# Altium project BMS.PrjPcb
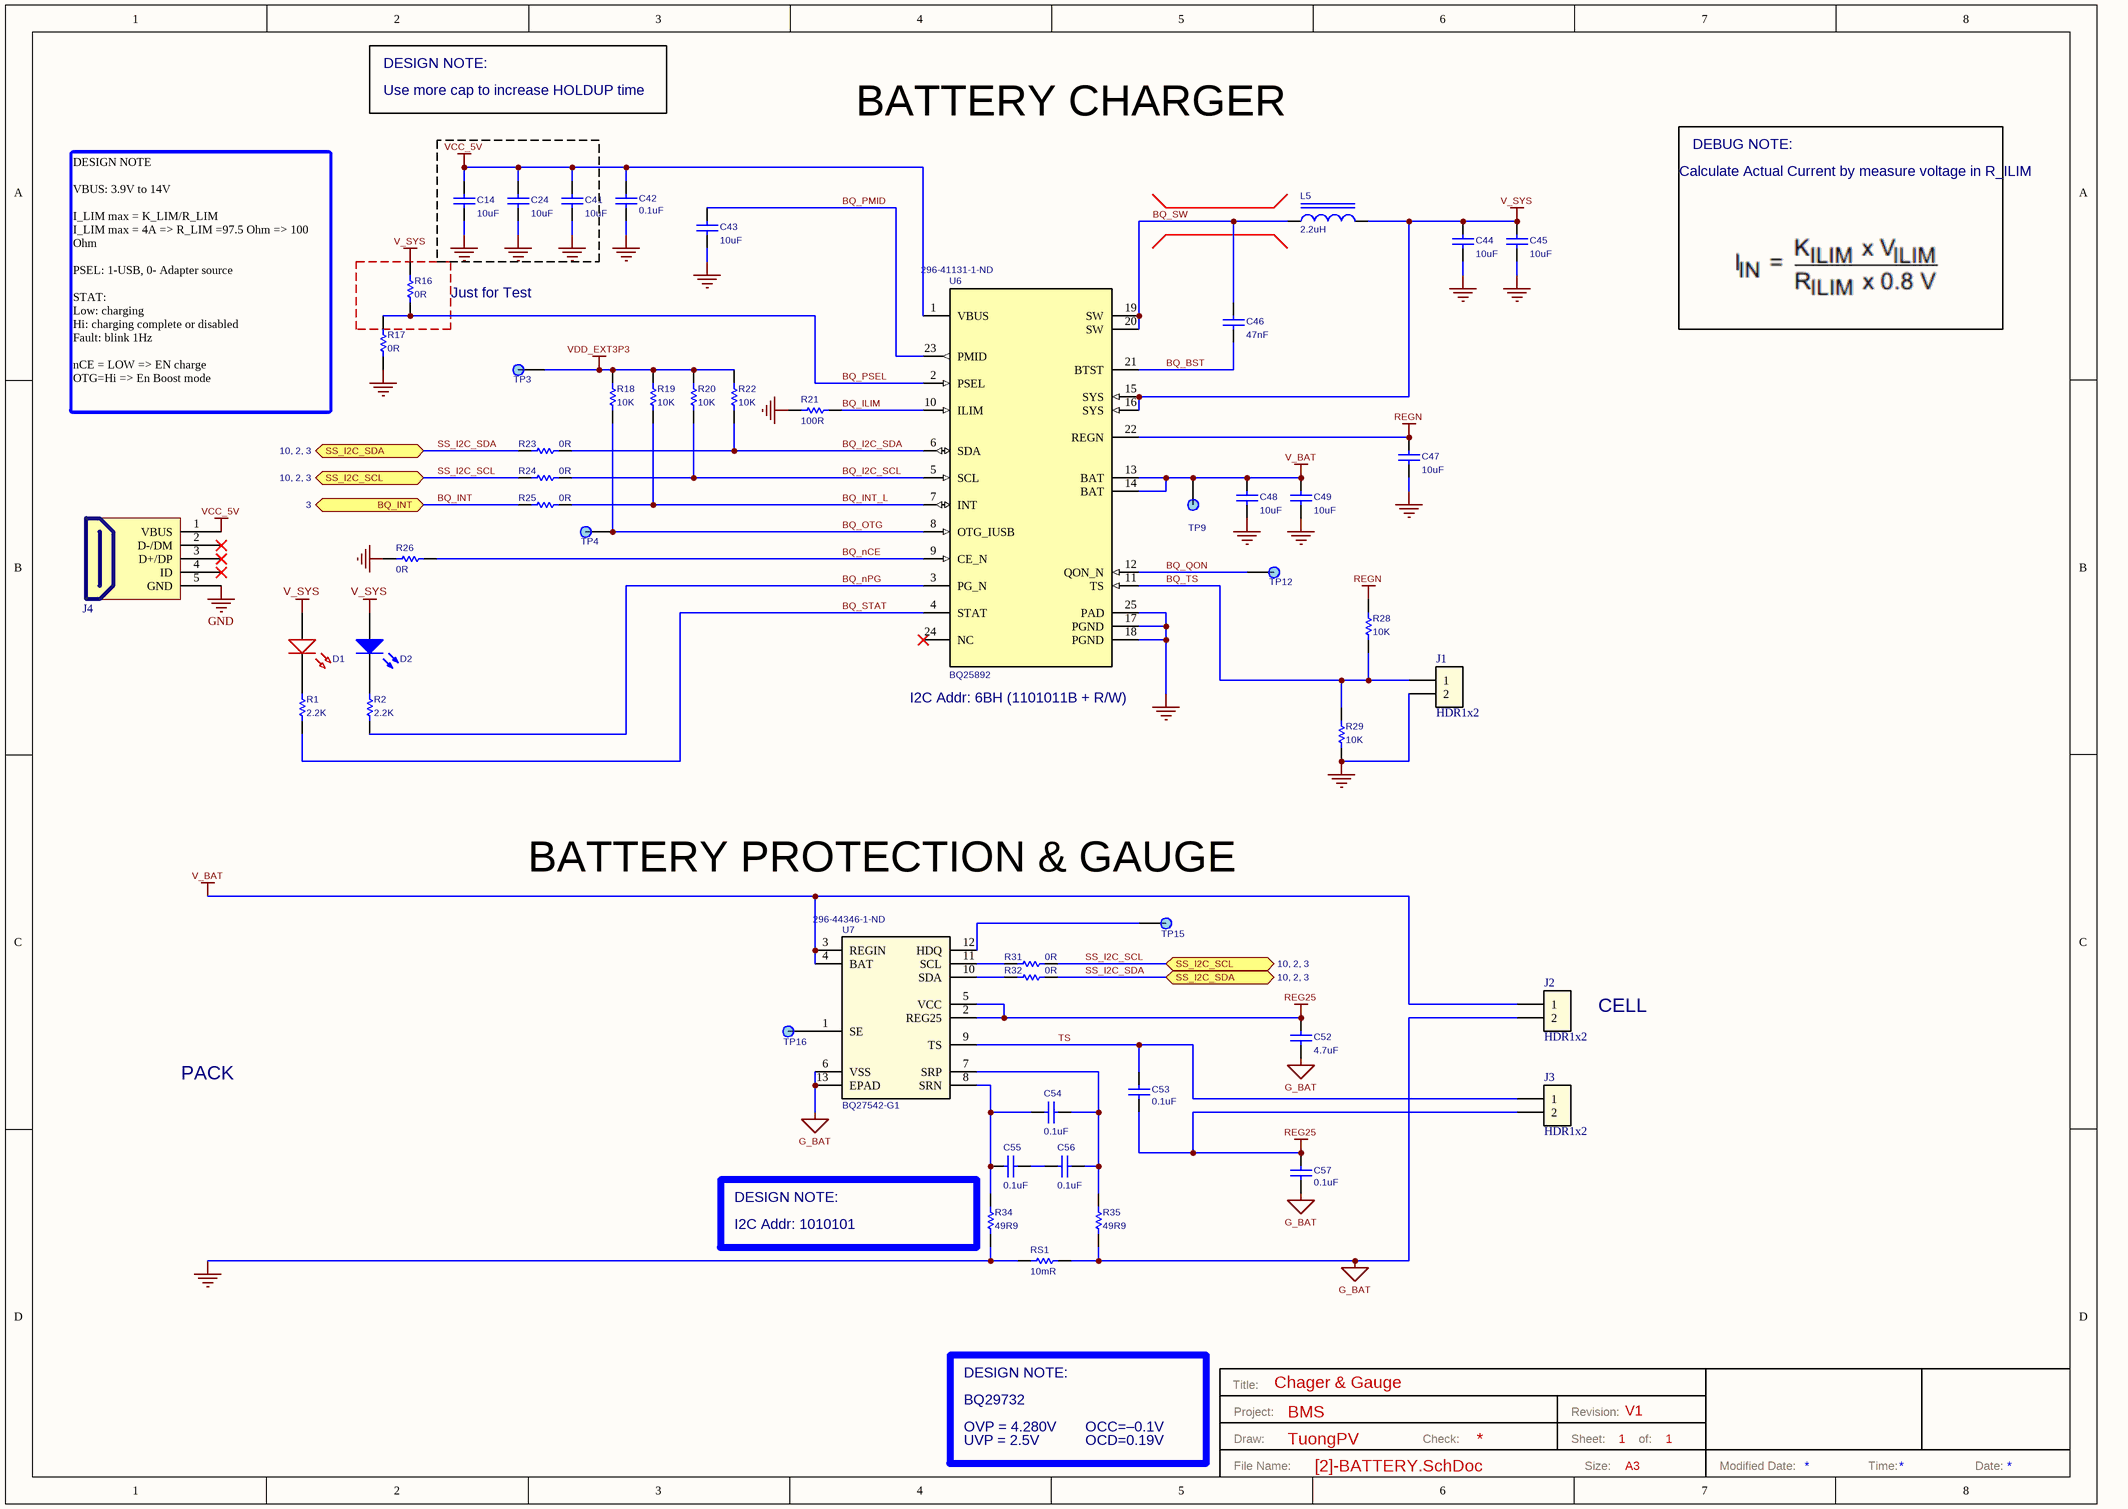
[diagram p0: [2]-BATTERY.SchDoc]
Engineer: TuongPV; Project: BMS; SCH_REV: V1
1 sheet, 52 parts. Net scope: flat (ports and power ports of the same name join across sheets).
Board file: BMS.PcbDoc

## Sheet [2]-BATTERY.SchDoc: Chager & Gauge
size A3; DrawnBy: TuongPV; SheetNumber: 1; SheetTotal: 1; ProjectName: BMS

### Parts
C14  Capacitance: 10uF  [C0805]  (hidden comment: TMK212BBJ106KG-T)
C24  Capacitance: 10uF  [C0805]  (hidden comment: TMK212BBJ106KG-T)
C41  Capacitance: 10uF  [C0805]  (hidden comment: TMK212BBJ106KG-T)
C42  Capacitance: 0.1uF  [C0603]  (hidden comment: 0603B104K500CT)
C43  Capacitance: 10uF  [C0805]  (hidden comment: TMK212BBJ106KG-T)
C44  Capacitance: 10uF  [C0805]  (hidden comment: TMK212BBJ106KG-T)
C45  Capacitance: 10uF  [C0805]  (hidden comment: TMK212BBJ106KG-T)
C46  Capacitance: 47nF  [C0402]  (hidden comment: GRM155R71C473KA01D)
C47  Capacitance: 10uF  [C0805]  (hidden comment: TMK212BBJ106KG-T)
C48  Capacitance: 10uF  [C0805]  (hidden comment: TMK212BBJ106KG-T)
C49  Capacitance: 10uF  [C0805]  (hidden comment: TMK212BBJ106KG-T)
C52  Capacitance: 4.7uF  [C0603]  (hidden comment: CL10A475KQ8NNNC)
C53  Capacitance: 0.1uF  [C0603]  (hidden comment: 0603B104K500CT)
C54  Capacitance: 0.1uF  [C0603]  (hidden comment: 0603B104K500CT)
C55  Capacitance: 0.1uF  [C0603]  (hidden comment: 0603B104K500CT)
C56  Capacitance: 0.1uF  [C0603]  (hidden comment: 0603B104K500CT)
C57  Capacitance: 0.1uF  [C0603]  (hidden comment: 0603B104K500CT)
D1  LED_WHITE_0603  [LED_BLUE_0603_TOP]  (value not drawn)
D2  LED_BLUE_0603  [LED_BLUE_0603_TOP]  (value not drawn)
J1  HDR1x2  [HDR1x2]
J2  HDR1x2  [HDR1x2]
J3  HDR1x2  [HDR1x2]
J4  microUSB  [MICRO_USB_SMD]  (value not drawn)
L5  Inductance: 2.2uH  [SRP5020TA]  (hidden comment: SRP5020TA-2R2M)
R1  Resistance (Ohms): 2.2K  [R0603]  (hidden comment: WR06X222 JTL)
R2  Resistance (Ohms): 2.2K  [R0603]  (hidden comment: WR06X222 JTL)
R16  Resistance (Ohms): 0R  [R0603]  (hidden comment: WR06X000 PTL)  (no BOM)
R17  Resistance (Ohms): 0R  [R0603]  (hidden comment: WR06X000 PTL)
R18  Resistance (Ohms): 10K  [R0603]  (hidden comment: WR06X103 JTL)  (no BOM)
R19  Resistance (Ohms): 10K  [R0603]  (hidden comment: WR06X103 JTL)  (no BOM)
R20  Resistance (Ohms): 10K  [R0603]  (hidden comment: WR06X103 JTL)  (no BOM)
R21  Resistance (Ohms): 100R  [R0603]  (hidden comment: RC0603FR-07100RL)
R22  Resistance (Ohms): 10K  [R0603]  (hidden comment: WR06X103 JTL)  (no BOM)
R23  Resistance (Ohms): 0R  [R0603]  (hidden comment: WR06X000 PTL)
R24  Resistance (Ohms): 0R  [R0603]  (hidden comment: WR06X000 PTL)
R25  Resistance (Ohms): 0R  [R0603]  (hidden comment: WR06X000 PTL)
R26  Resistance (Ohms): 0R  [R0603]  (hidden comment: WR06X000 PTL)
R28  Resistance (Ohms): 10K  [R0603]  (hidden comment: WR06X103 JTL)
R29  Resistance (Ohms): 10K  [R0603]  (hidden comment: WR06X103 JTL)
R31  Resistance (Ohms): 0R  [R0603]  (hidden comment: WR06X000 PTL)
R32  Resistance (Ohms): 0R  [R0603]  (hidden comment: WR06X000 PTL)
R34  Resistance (Ohms): 49R9  [R0603]  (hidden comment: RC0603FR-0749R9L)
R35  Resistance (Ohms): 49R9  [R0603]  (hidden comment: RC0603FR-0749R9L)
RS1  Resistance (Ohms): 10mR  [R2512L]  (hidden comment: PA2512FKF7W0R001E)
TP3  TestPoint  [TESTPOINT]  (value not drawn)  (no BOM)
TP4  TestPoint  [TESTPOINT]  (value not drawn)  (no BOM)
TP9  TestPoint  [TESTPOINT]  (value not drawn)  (no BOM)
TP12  TestPoint  [TESTPOINT]  (value not drawn)  (no BOM)
TP15  TestPoint  [TESTPOINT]  (value not drawn)  (no BOM)
TP16  TestPoint  [TESTPOINT]  (value not drawn)  (no BOM)
U6  BQ25892  Supplier Part Number 1: 296-41131-1-ND  [QFN24-4x4x0.8-0.5]
U7  BQ27542-G1  Supplier Part Number 2: 296-44346-1-ND  [BQ27542DRZR-G1]

### Ports
BQ_INT (bidir, see 3), SS_I2C_SCL (bidir, see 10, 2, 3), SS_I2C_SDA (bidir, see 10, 2, 3)

### Nets
G_BAT: C52.1 C57.1 J2.2 R35.1 RS1.2 U7.6(VSS) U7.13(EPAD)
GND: C14.1 C24.1 C41.1 C42.1 C43.1 C44.1 C45.1 C47.1 C48.1 C49.1 J1.2 J4.5(GND) R17.2 R21.2 R26.1 R29.2 R34.1 RS1.1 U6.17(PGND) U6.18(PGND) U6.25(PAD)
REG25: C52.2 C53.1 C57.2 J3.2 U7.2(REG25) U7.5(VCC)
REGN: C47.2 R28.1 U6.22(REGN)
V_BAT: C48.2 C49.2 J2.1 TP9.1 U6.13(BAT) U6.14(BAT) U7.3(REGIN) U7.4(BAT)
V_SYS: C44.2 C45.2 D1.1(A) D2.1(A) L5.2 R16.1 U6.15(SYS) U6.16(SYS)
VCC_5V: C14.2 C24.2 C41.2 C42.2 J4.1(VBUS) U6.1(VBUS)
VDD_EXT3P3: R18.1 R19.1 R20.1 R22.1 TP3.1
BQ_BST: C46.1 U6.21(BTST)
BQ_I2C_SCL: R20.2 R24.1 U6.5(SCL)
BQ_I2C_SDA: R22.2 R23.1 U6.6(SDA)
BQ_ILIM: R21.1 U6.10(ILIM)
BQ_INT: R25.2 ; port BQ_INT
BQ_INT_L: R19.2 R25.1 U6.7(INT)
BQ_nCE: R26.2 U6.9(CE_N)
BQ_nPG: R2.1 U6.3(PG_N)
BQ_OTG: R18.2 TP4.1 U6.8(OTG_IUSB)
BQ_PMID: C43.2 U6.23(PMID)
BQ_PSEL: R16.2 R17.1 U6.2(PSEL)
BQ_QON: TP12.1 U6.12(QON_N)
BQ_STAT: R1.1 U6.4(STAT)
BQ_SW: C46.2 L5.1 U6.19(SW) U6.20(SW)
BQ_TS: J1.1 R28.2 R29.1 U6.11(TS)
SS_I2C_SCL: R24.2 R31.1 ; port SS_I2C_SCL
SS_I2C_SDA: R23.2 R32.1 ; port SS_I2C_SDA
TS: C53.2 J3.1 U7.9(TS)
NetC54_1: C54.1 C56.1 R35.2 U7.7(SRP)
NetC54_2: C54.2 C55.2 R34.2 U7.8(SRN)
NetC55_1: C55.1 C56.2
NetD1_2: D1.2(K) R1.2
NetD2_2: D2.2(K) R2.2
NetR31_2: R31.2 U7.11(SCL)
NetR32_2: R32.2 U7.10(SDA)
NetTP15_1: TP15.1 U7.12(HDQ)
NetTP16_1: TP16.1 U7.1(SE)

Not connected (* = marked no-connect by the designer): J4 2(D-/DM)* 3(D+/DP)* 4(ID)*; U6 24(NC)*

### Notes on the sheet
- Use more cap to increase HOLDUP time
- DESIGN NOTE:
- BATTERY CHARGER
- Calculate Actual Current by measure voltage in R_ILIM
- DEBUG NOTE:
- (near R16) Just for Test
- DESIGN NOTE
  VBUS: 3.9V to 14V
  I_LIM max = K_LIM/R_LIM
  I_LIM max = 4A => R_LIM =97.5 Ohm => 100 Ohm
  PSEL: 1-USB, 0- Adapter source
  STAT:
  Low: charging
  Hi: charging complete or disabled
  Fault: blink 1Hz
  nCE = LOW => EN charge
  OTG=Hi => En Boost mode
- (near U6) I2C Addr: 6BH (1101011B + R/W)
- (near TP15) BATTERY PROTECTION & GAUGE
- CELL
- PACK
- I2C Addr: 1010101
- BQ29732
- OVP = 4.280V
- UVP = 2.5V
- OCC=–0.1V
- OCD=0.19V
- Title:
- Project:
- Draw:
- Check:
- Revision:
- Sheet:
- of:
- File Name:
- Size:
- A3
- Modified Date:
- Time:
- Date:

### Library data of the parts
C14 C24 C41 C43-C45 C47-C49 = CAP_10uF_0805: CAP, CERM, 10uF, 25V, +/-10%, X5R, 0402; Manufacturer Device Package: 0805; Manufacturer: Taiyo Yuden; Lumi PART: CAP_10uF_0805; Manufacturer Part Number: TMK212BBJ106KG-T; Size / Dimension: 2.0mm x 1.25mm x 1.25mm; Alias: CAP_10uF_0805; Operating voltage: 25V; Price: 0.035
C42 C53-C57 = CERM_0.1uF_0603: CAP, CERM, 0.1uF, 50V, +/-10%, X7R, 0603; Manufacturer Device Package: 0603 (1608 Metric); Lumi PART: CAP_104_0603; Manufacturer: Walsin; Alias: CAP_0.1uF_0603; Manufacturer Part Number: 0603B104K500CT; Size / Dimension: 1.60mm x 0.80mm x 0.8mm; Operating voltage: 50V
C46 = CAP_47nF_0402: CAP, CERM, 47nF, 16V, +/-10%, X7R, 0402; Manufacturer Device Package: 0402; Manufacturer: Murata; Lumi PART: CAP_47nF_0402; Manufacturer Part Number: GRM155R71C473KA01D; Size / Dimension: 1.0mm x 0.5mm x 0.5mm; Alias: CAP_47nF_0402; Operating voltage: 16V; Price: 0.012
C52 = CAP_4.7uF_0603: CAP, CERM, 4.7uF, 6.3V, +/-10%, X5R, 0603; Manufacturer Device Package: 0603; Manufacturer: Samsung Electro-Mechanics; Lumi PART: CAP_4.7uF_0603; Manufacturer Part Number: CL10A475KQ8NNNC; Size / Dimension: 1.6mm x 0.8mm x 0.8mm; Alias: CAP_4.7uF_0603; Operating voltage: 6.3V; Price: 0.012
D1 = LED_WHITE_0603: LED, Mono Colour, WHITE, Top View, SMD 0603; Manufacturer: Everlight; Manufacturer Part Number: 19-218/T1D-CQ2R2TY/3T; Manufacturer Device Package: 0603 (1608 Metric); Max. operating voltage: 3V; Forward Voltage: 3.1V; Size / Dimension: 2.0mm x 1.60mm; LUMI PART: LED_WHITE_0603; Alias: LED_WHITE_0603
D2 = LED_BLUE_0603: LED, Mono Colour, BLUE, Top View, SMD 0603; Manufacturer: Everlight; Manufacturer Part Number: 19-217/BHC-ZL1M2RY/3T; Manufacturer Device Package: 0603 (1608 Metric); Max. operating voltage: 3V; Forward Voltage: 3.1V; Size / Dimension: 2.0mm x 1.60mm; LUMI PART: LED_BLUE_0603; Alias: LED_BLUE_0603
J1-J3 = HDR1x2: Header 1x2 2.54mm
J4 = microUSB: USB - micro B USB 2.0 Receptacle Connector 5 Position Surface Mount, Right Angle, Horizontal; Manufacturer: Amphenol FCI; Manufacturer Part Number: 10118194-0001LF; Number of Contacts: 5; Specifications: USB 2.0; Supplier 1: Digi-Key; RoHS: RoHS Compliant; Category: Connectors, Interconnects; Stock 1: 159600; Pricing 1: 1200=0.19845, 2400=0.18144, 6000=0.1701, 8400=0.15876, 12000=0.15309, 30000=0.15082, 60000=0.14742 (USD); Packaging: Tape & Reel (TR); Part Status: Active; Connector Type: USB - micro B; Gender: Receptacle; Mounting Type: Surface Mount, Right Angle, Horizontal; Features: Shielded, Solder Retention; Ingress Protection: -; ComponentLink1URL: http://portal.fciconnect.com/Comergent//fci/drawing/10118194.pdf; ComponentLink1Description: http://portal.fciconnect.com/Comergent//fci/drawing/10118194.pdf; Supplier Part Number 1: 609-4618-2-ND
L5 = SRP5020TA-2R2M: IND,5.7X5.2X1.8MM,2.2UH20%,4.2A; Manufacturer: Bourns; Size / Dimension: 5.7X5.2X1.8MM; Manufacturer Part Number: SRP5020TA-2R2M; LUMI PART: SRP5020TA-2R2M; Manufacturer Device Package: 5.7X5.2X1.8MM; Alias: SRP5020TA-2R2M; DC Current: 4.2A
R1 R2 = RES_2.2K_0603: RES, SMD, ThickFilm, 2.2K, 1/10W, 5%, 0603; Manufacturer: Walsin; Manufacturer Device Package: 0603 (1608 Metric); Power (Watts): 0.1W, 1/10W; Size / Dimension: 1.60mm x 0.80mm x 0.45mm; Manufacturer Part Number: WR06X222 JTL; LUMI PART: RES_2.2K_0603; Alias: RES_2.2K_0603
R16 R17 R23-R26 R31 R32 = RES_0R_0603: RES, SMD, ThickFilm, 0R, JUMPER, 0603; Manufacturer: Walsin; Manufacturer Device Package: 0603 (1608 Metric); Power (Watts): 0.1W, 1/10W; Manufacturer Part Number: WR06X000 PTL; LUMI PART: RES_0R_0603; Size / Dimension: 1.60mm x 0.80mm x 0.45mm; Alias: RES_0R_0603
R18-R20 R22 R28 R29 = RES_10K_0603: RES, SMD, ThickFilm, 10K, 1/10W, 5%, 0603; Manufacturer: Walsin; Manufacturer Device Package: 0603 (1608 Metric); Power (Watts): 0.1W, 1/10W; Size / Dimension: 1.60mm x 0.80mm x 0.45mm; Manufacturer Part Number: WR06X103 JTL; LUMI PART: RES_10K_0603; Alias: RES_10K_0603
R21 = RES_100R_0603: RES, SMD, ThickFilm, 100R, 1/10W, 1%, 0603; Manufacturer: Yageo; Manufacturer Device Package: 0603 (1608 Metric); Power (Watts): 0.1W, 1/10W; Size / Dimension: 1.60mm x 0.80mm x 0.45mm; Manufacturer Part Number: RC0603FR-07100RL; LUMI PART: RES_100R_0603; Alias: RES_100R_0603
R34 R35 = RES_49R9_0603: RES, SMD, ThickFilm, 49R9, 1/10W, 1%, 0603; Manufacturer: Yageo; Manufacturer Device Package: 0603 (1608 Metric); Power (Watts): 0.1W, 1/10W; Size / Dimension: 1.60mm x 0.80mm x 0.45mm; Manufacturer Part Number: RC0603FR-0749R9L; LUMI PART: RES_49R9_0603; Alias: RES_49R9_0603
RS1 = RES_1mR_2512: RES, SMD, Current Sense Resistors, 1mOhms, 2W, 1%, 2512; Manufacturer: Yageo; Manufacturer Device Package: 2512; Size / Dimension: 6.3mm x 3.2mm x 0.6mm; Power (Watts): 2W; Manufacturer Part Number: PA2512FKF7W0R001E; LUMI PART: RES_1mR_2512; Alias: RES_1mR_2512; Price: 0.15
TP3 TP4 TP9 TP12 TP15 TP16 = TestPoint: Manufacture: LUMI; Alias: TestPoint; Part: TestPoint; Part Number: TestPoint; Dielectric: TestPoint; Dimension: 1mm*1mm; Publisher: LUMIVN; Published: 2016/07/01; Component Type: NO BOM
U6 = BQ25892: 1S 5A Fast Charger MaxCharge; Manufacturer: Texas Instruments; Manufacturer Part Number: BQ25892RTWT; Number of Cells: 1; Output Voltage: 4.6V; Max Supply Voltage: 14V; Interface: I2C,USB; Fault Protection: Over Current,Over Temperature; Supplier 1: Digi-Key; Stock 1: 460; Pricing 1: 1 = 4.14000, 10 = 3.72100, 100 = 2.89250 (USD); RoHS: Yes; Mount: Surface Mount; Number of Pins: 24; Contact Plating: Gold; Min Operating Temperature: -40°C; Max Operating Temperature: 85°C; Output Current: 5A; Packaging: Cut Tape; Max Charge Current: 5A; REACH SVHC: No SVHC; Lead Free: Lead Free; ComponentLink1URL: http://www.ti.com/lit/pdf/sluubb8?src-supplier=Digi-Key; ComponentLink1Description: http://www.ti.com/lit/pdf/sluubb8?src-supplier=Digi-Key; ComponentLink2URL: http://www.ti.com/lit/ds/symlink/bq25890.pdf?src-supplier=Digi-Key; ComponentLink2Description: http://www.ti.com/lit/ds/symlink/bq25890.pdf?src-supplier=Digi-Key; ComponentLink3URL: http://www.ti.com/general/docs/lit/getliterature.tsp?genericPartNumber=BQ25892&&fileType=pdf&src-supplier=Element14; ComponentLink3Description: http://www.ti.com/general/docs/lit/getliterature.tsp?genericPartNumber=BQ25892&&fileType=pdf&src-supplier=Element14; ComponentLink4URL: http://www.ti.com/lit/ds/symlink/bq25892.pdf?src-supplier=Avnet; ComponentLink4Description: http://www.ti.com/lit/ds/symlink/bq25892.pdf?src-supplier=Avnet; ComponentLink5URL: http://www.ti.com/general/docs/lit/getliterature.tsp?genericPartNumber=BQ25892&amp;&amp;fileType=pdf&src-supplier=Farnell; ComponentLink5Description: http://www.ti.com/general/docs/lit/getliterature.tsp?genericPartNumber=BQ25892&amp;&amp;fileType=pdf&src-supplier=Farnell; ComponentLink6URL: http://www.ti.com/general/docs/lit/getliterature.tsp?genericPartNumber=BQ25892&&fileType=pdf&src-supplier=Farnell; ComponentLink6Description: http://www.ti.com/general/docs/lit/getliterature.tsp?genericPartNumber=BQ25892&&fileType=pdf&src-supplier=Farnell
U7 = BQ27542-G1: Manufacturer: Texas Instruments; Manufacturer Part Number: BQ27541DRZR-G1; Capacity: 16000mAh; Min Supply Voltage: 2.7V; Max Supply Voltage: 5.5V; Interface: I2C; Supplier 1: Digi-Key; Supplier Part Number 1: 296-34998-1-ND; Stock 1: 9527; Pricing 1: 1 = 3.57000, 10 = 3.20900, 100 = 2.49430, 500 = 2.15724, 1000 = 1.79320 (USD); RoHS: Yes; Number of Pins: 12; Min Operating Temperature: -40°C; Max Operating Temperature: 85°C; Package Quantity: 3000; Packaging: Tape and Reel; Radiation Hardening: No; Lead Free: Lead Free; REACH SVHC: No SVHC; ComponentLink1URL: https://datasheet.ciiva.com/24097/slusal6c-261693-24097200.pdf?src-supplier=Mouser; ComponentLink1Description: https://datasheet.ciiva.com/24097/slusal6c-261693-24097200.pdf?src-supplier=Mouser; ComponentLink2URL: https://datasheet.ciiva.com/6613/bq27541-g1-6613718.pdf?src-supplier=Digi-Key; ComponentLink2Description: https://datasheet.ciiva.com/6613/bq27541-g1-6613718.pdf?src-supplier=Digi-Key; ComponentLink3URL: https://datasheet.ciiva.com/6613/bq27541-g1-6613717.pdf?src-supplier=Digi-Key; ComponentLink3Description: https://datasheet.ciiva.com/6613/bq27541-g1-6613717.pdf?src-supplier=Digi-Key; ComponentLink4URL: https://datasheet.ciiva.com/28425/bq27541-g1-28425989.pdf?src-supplier=Avnet+Europe; ComponentLink4Description: https://datasheet.ciiva.com/28425/bq27541-g1-28425989.pdf?src-supplier=Avnet+Europe; Supplier 2: Digi-Key; Stock 2: 16878; Pricing 2: 1 = 2.69000, 10 = 2.41700, 100 = 1.87880, 500 = 1.62492, 1000 = 1.35072 (USD); Mount: Surface Mount; Contact Plating: Gold; Operating Supply Voltage: 5.5V; ComponentLink5URL: http://www.ti.com/lit/pdf/sluub65?src-supplier=Digi-Key; ComponentLink5Description: http://www.ti.com/lit/pdf/sluub65?src-supplier=Digi-Key; ComponentLink6URL: http://www.ti.com/general/docs/lit/getliterature.tsp?genericPartNumber=BQ27542-G1&amp;&amp;fileType=pdf&src-supplier=Avnet+Asia; ComponentLink6Description: http://www.ti.com/general/docs/lit/getliterature.tsp?genericPartNumber=BQ27542-G1&amp;&amp;fileType=pdf&src-supplier=Avnet+Asia; ComponentLink7URL: http://www.ti.com/lit/gpn/bq27542-g1?src-supplier=Mouser; ComponentLink7Description: http://www.ti.com/lit/gpn/bq27542-g1?src-supplier=Mouser; ComponentLink8URL: http://www.ti.com/general/docs/lit/getliterature.tsp?genericPartNumber=BQ27542-G1&&fileType=pdf&src-supplier=Avnet; ComponentLink8Description: http://www.ti.com/general/docs/lit/getliterature.tsp?genericPartNumber=BQ27542-G1&&fileType=pdf&src-supplier=Avnet; ComponentLink9URL: http://www.ti.com/lit/ds/symlink/bq27542-g1.pdf?src-supplier=Digi-Key; ComponentLink9Description: http://www.ti.com/lit/ds/symlink/bq27542-g1.pdf?src-supplier=Digi-Key